# EAGLE design Own_RPi.Streamerboard.pro_v1.3_Final_AR (EAGLE 9.6.2)
COMPANY: ADAFRUIT INDUSTRIES; DRAWN: KTOWN; REV: A; YEAR: 2019
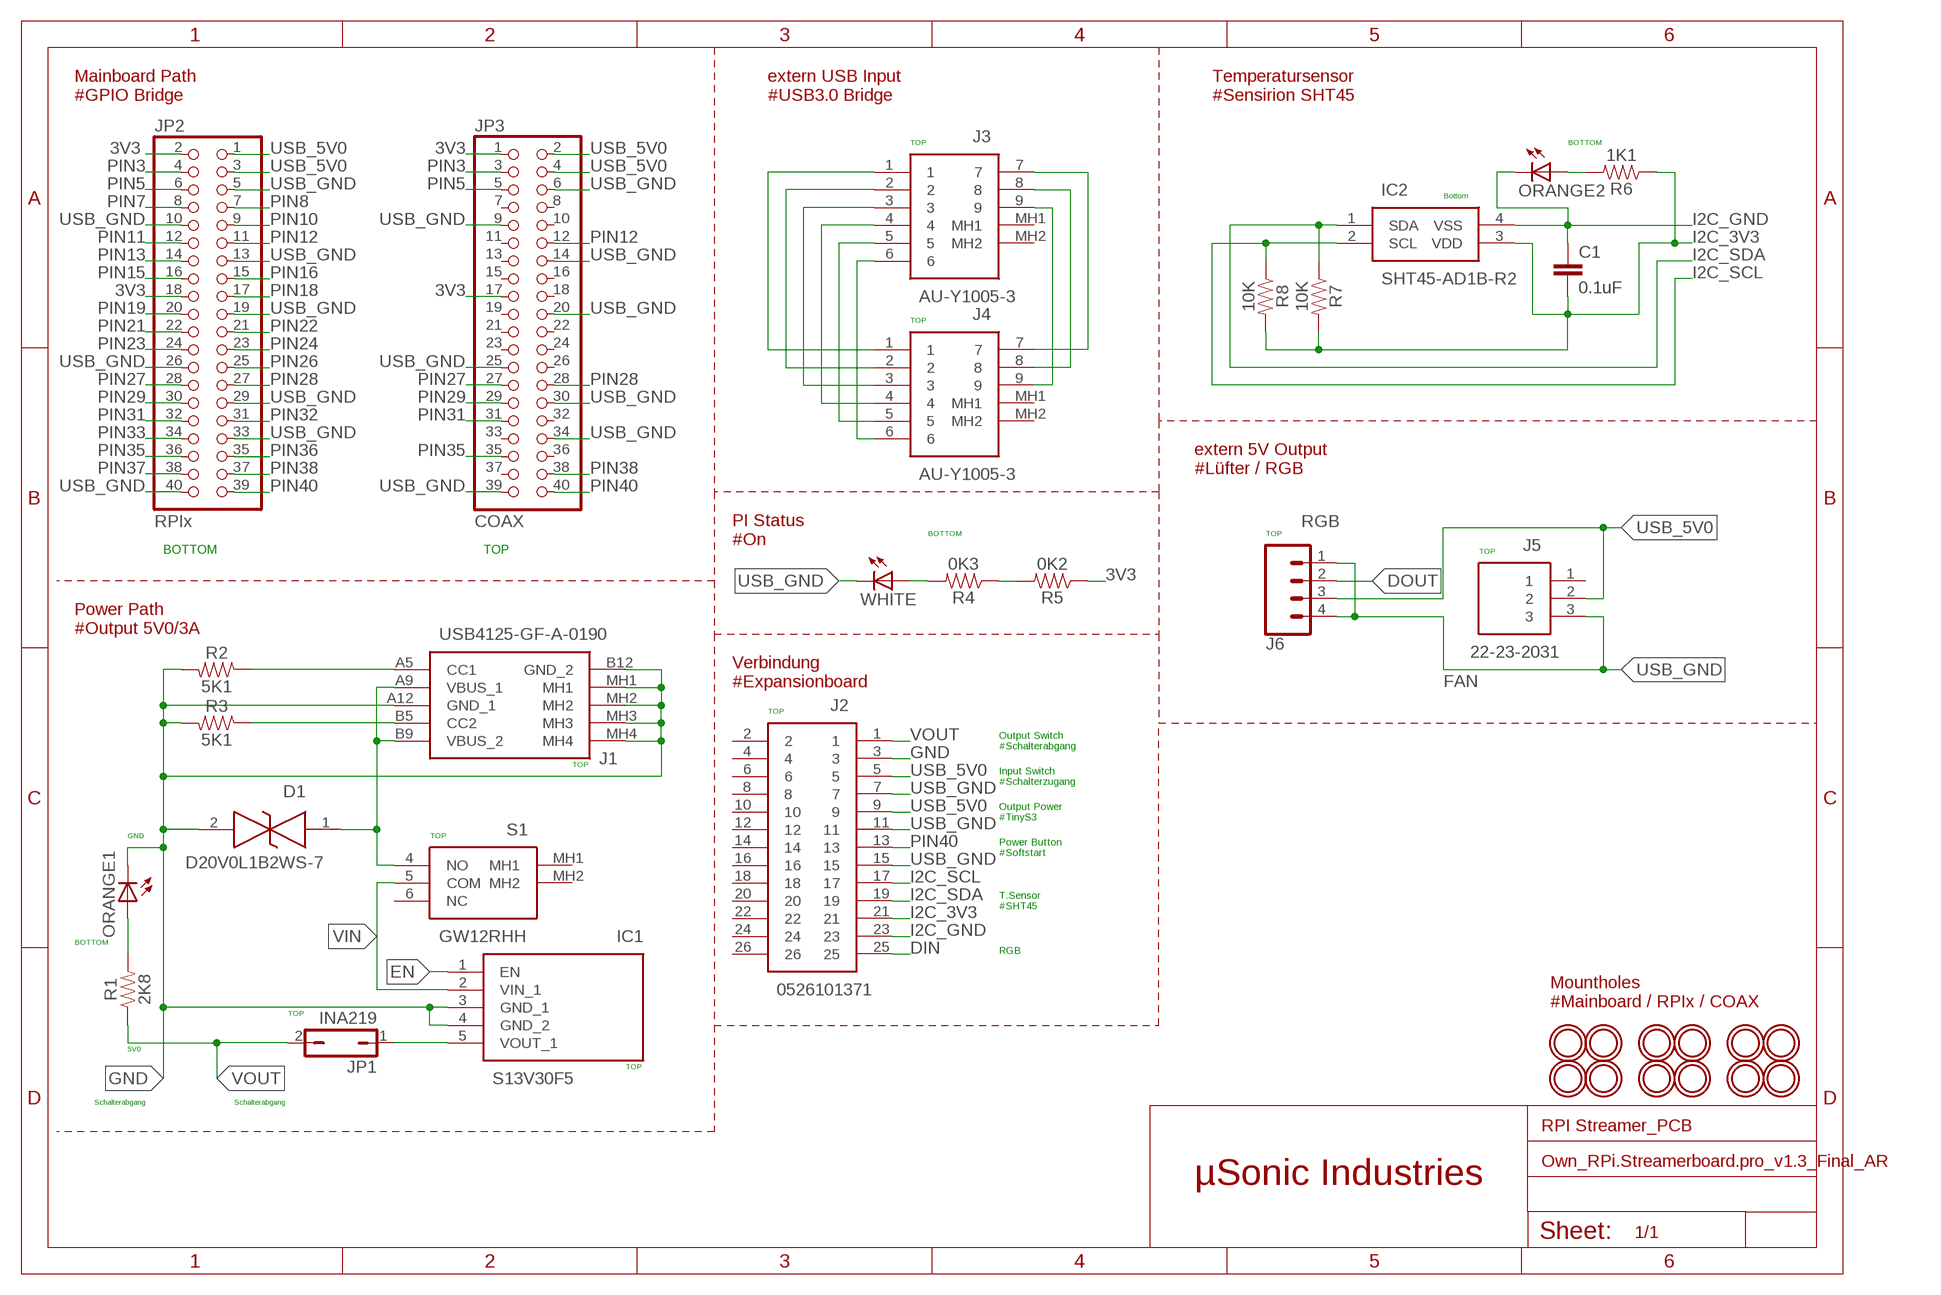
[diagram p0: schematic, sheet 1]

## Parts
C1  0.1uF  1.0UF-0805-25V-10%  [0805]
D1  D20V0L1B2WS-7  [SOD2513X120N]
IC1  S13V30F5  [S13V30F5]
IC2  SHT45-AD1B-R2  [SHT45AD1BR2]
J1  USB4125-GF-A-0190  [USB4125GFA0190]
J2  0526101371  [0526101371]
J3  AU-Y1005-3  [AUY10053]
J4  AU-Y1005-3  [AUY10053]
J5  22-23-2031  [SHDR3W82P0X254_1X3_747X635X818]
J6  CONN_041X04_NO_SILK  [1X04_NO_SILK]
JP1  INA219  JP1Q2JP2  [1X02_NO_SILK]
JP2  RPIx  PINHD-2X20-BIG  [2X20-BIG]
JP3  COAX  PINHD-2X20-BIG  [2X20-BIG]
ORANGE1  LEDCHIPLED_0805  [CHIPLED_0805]
ORANGE2  LEDCHIPLED_0805  [CHIPLED_0805]
R1  2K8  RESISTOR0805  [0805]
R2  5K1  RESISTOR0805  [0805]
R3  5K1  RESISTOR0805  [0805]
R4  0K3  RESISTOR0805  [0805]
R5  0K2  RESISTOR0805  [0805]
R6  1K1  RESISTOR0805  [0805]
R7  10K  RESISTOR0805  [0805]
R8  10K  RESISTOR0805  [0805]
S1  GW12RHH  [GW12RHH]
U$4  MOUNTINGHOLE2.5  [MOUNTINGHOLE_2.5_PLATED]
U$5  MOUNTINGHOLE2.5  [MOUNTINGHOLE_2.5_PLATED]
U$6  MOUNTINGHOLE2.5  [MOUNTINGHOLE_2.5_PLATED]
U$7  MOUNTINGHOLE2.5  [MOUNTINGHOLE_2.5_PLATED]
U$8  MOUNTINGHOLE2.5  [MOUNTINGHOLE_2.5_PLATED]
U$10  MOUNTINGHOLE2.5  [MOUNTINGHOLE_2.5_PLATED]
U$11  MOUNTINGHOLE2.5  [MOUNTINGHOLE_2.5_PLATED]
U$13  MOUNTINGHOLE2.5  [MOUNTINGHOLE_2.5_PLATED]
U$14  MOUNTINGHOLE2.5  [MOUNTINGHOLE_2.5_PLATED]
U$15  MOUNTINGHOLE2.5  [MOUNTINGHOLE_2.5_PLATED]
U$16  MOUNTINGHOLE2.5  [MOUNTINGHOLE_2.5_PLATED]
U$17  MOUNTINGHOLE2.5  [MOUNTINGHOLE_2.5_PLATED]
WHITE  LEDCHIPLED_0805  [CHIPLED_0805]

## Nets
3V3: JP2.2 JP2.18 JP3.1 JP3.17 R5.1
DIN: J2.25
DOUT: J6.2
EN: IC1.1(EN)
GND: D1.2 IC1.3(GND_1) IC1.4(GND_2) J1.A12(GND_1) J1.B12(GND_2) J1.MH1 J1.MH2 J1.MH3 J1.MH4 J2.3 ORANGE1.C R2.2 R3.2
I2C_3V3: C1.2 IC2.3(VDD) J2.21 R6.1 R7.2 R8.2
I2C_GND: C1.1 IC2.4(VSS) J2.23 ORANGE2.C
I2C_SCL: IC2.2(SCL) J2.17 R8.1
I2C_SDA: IC2.1(SDA) J2.19 R7.1
N$1: ORANGE1.A R1.2
N$2: R4.1 R5.2
N$3: J1.B5(CC2) R3.1
N$4: J1.A5(CC1) R2.1
N$5: J3.4 J4.4
N$6: ORANGE2.A R6.2
N$7: R4.2 WHITE.A
N$8: IC1.5(VOUT_1) JP1.1
N$15: J3.6 J4.6
N$17: J3.5 J4.5
N$19: J3.3 J4.3
N$20: J3.2 J4.2
N$21: J3.1 J4.1
N$22: J3.9 J4.9
N$23: J3.8 J4.8
N$24: J3.7 J4.7
PIN3: JP2.4 JP3.3
PIN5: JP2.6 JP3.5
PIN7: JP2.8
PIN8: JP2.7
PIN10: JP2.9
PIN11: JP2.12
PIN12: JP2.11 JP3.12
PIN13: JP2.14
PIN15: JP2.16
PIN16: JP2.15
PIN18: JP2.17
PIN19: JP2.20
PIN21: JP2.22
PIN22: JP2.21
PIN23: JP2.24
PIN24: JP2.23
PIN26: JP2.25
PIN27: JP2.28 JP3.27
PIN28: JP2.27 JP3.28
PIN29: JP2.30 JP3.29
PIN31: JP2.32 JP3.31
PIN32: JP2.31
PIN33: JP2.34
PIN35: JP2.36 JP3.35
PIN36: JP2.35
PIN37: JP2.38
PIN38: JP2.37 JP3.38
PIN40: J2.13 JP2.39 JP3.40
USB_5V0: J2.5 J2.9 J5.2 J6.3 JP2.1 JP2.3 JP3.2 JP3.4
USB_GND: J2.7 J2.11 J2.15 J5.3 J6.1 J6.4 JP2.5 JP2.10 JP2.13 JP2.19 JP2.26 JP2.29 JP2.33 JP2.40 JP3.6 JP3.9 JP3.14 JP3.20 JP3.25 JP3.30 JP3.34 JP3.39 WHITE.C
VBUS_VIN: D1.1 J1.A9(VBUS_1) J1.B9(VBUS_2) S1.4(NO)
VIN: IC1.2(VIN_1) S1.5(COM)
VOUT: J2.1 JP1.2 R1.1
Unconnected: J2.2 J2.4 J2.6 J2.8 J2.10 J2.12 J2.14 J2.16 J2.18 J2.20 J2.22 J2.24 J2.26 J3.MH1 J3.MH2 J4.MH1 J4.MH2 J5.1 JP3.7 JP3.8 JP3.10 JP3.11 JP3.13 JP3.15 JP3.16 JP3.18 JP3.19 JP3.21 JP3.22 JP3.23 JP3.24 JP3.26 JP3.32 JP3.33 JP3.36 JP3.37 S1.6(NC) S1.MH1 S1.MH2

## Notes on the sheet
- Mainboard Path
  #GPIO Bridge
- extern USB Input
  #USB3.0 Bridge
- Temperatursensor
  #Sensirion SHT45
- TOP | BOTTOM
- Bottom
- TOP
- extern 5V Output
  #Lüfter / RGB
- RGB
- BOTTOM | TOP
- PI Status
  #On
- BOTTOM | TOP | TOP
- Power Path
  #Output 5V0/3A
- Verbindung
  #Expansionboard
- FAN
- TOP
- Output Switch
  #Schalterabgang
- TOP
- Input Switch
  #Schalterzugang
- Output Power
  #TinyS3
- GND | TOP
- Power Button
  #Softstart
- T.Sensor
  #SHT45
- BOTTOM
- RGB
- Mountholes
  #Mainboard / RPIx / COAX
- TOP
- 5V0
- TOP
- Schalterabgang | Schalterabgang
- RPI Streamer_PCB
- µSonic Industries

## Library data of the parts
C1 = SparkFun-Capacitors:1.0UF: 1µF ceramic capacitors A capacitor is a passive two-terminal electrical component used to store electrical energy temporarily in an electric field.; PROD_ID: CAP-08064; VALUE: 1.0uF
D1 = D20V0L1B2WS-7:D20V0L1B2WS-7: Diodes Inc D20V0L1B2WS-7 Bi-Directional TVS Diode, 90W peak, 2-Pin SOD-323 Source: Datasheet <https://www.diodes.com/assets/Datasheets/D20V0L1B2WS.pdf>; DESCRIPTION: Diodes Inc D20V0L1B2WS-7 Bi-Directional TVS Diode, 90W peak, 2-Pin SOD-323; HEIGHT: 1.2mm; MANUFACTURER_NAME: Diodes Inc.; MANUFACTURER_PART_NUMBER: D20V0L1B2WS-7
IC1 = S13V30F5mod:S13V30F5: 5V Step-Up/Step-Down Voltage Regulator Source: Datasheet <https://www.pololu.com/file/0J1807/5v-step-up-step-down-voltage-regulator-s13v30f5-dimensions.pdf>; DESCRIPTION: 5V Step-Up/Step-Down Voltage Regulator; HEIGHT: 9.57mm; MANUFACTURER_NAME: Pololu; MANUFACTURER_PART_NUMBER: S13V30F5
IC2 = SHT45-AD1B-R2:SHT45-AD1B-R2: 4 4th Generation, High-Accuracy, Ultra-Low-Power, 16-bit Relative Humidity and Temperature Sensor Source: Datasheet <https://www.mouser.de/datasheet/2/682/Datasheet_SHT4x-2936319.pdf>; ARROW_PART_NUMBER: SHT45-AD1B-R2; ARROW_PRICE-STOCK: https://www.arrow.com/en/products/sht45-ad1b-r2/sensirion-ag?region=nac; DESCRIPTION: 4 4th Generation, High-Accuracy, Ultra-Low-Power, 16-bit Relative Humidity and Temperature Sensor; HEIGHT: 0.59mm; MANUFACTURER_NAME: Sensirion; MANUFACTURER_PART_NUMBER: SHT45-AD1B-R2; MOUSER_PART_NUMBER: 403-SHT45-AD1B-R2; MOUSER_PRICE-STOCK: https://www.mouser.co.uk/ProductDetail/Sensirion/SHT45-AD1B-R2?qs=Znm5pLBrcAImXcmTJwn%2FTg%3D%3D
J1 = USB4125-GF-A-0190mod:USB4125-GF-A-0190: USB Connectors USB C Rec GF RA 6P SMT TH Stakes 1.9mm Source: Datasheet <https://eu.mouser.com/datasheet/2/837/usb4125-2448699.pdf>; DESCRIPTION: USB Connectors USB C Rec GF RA 6P SMT TH Stakes 1.9mm; HEIGHT: 3.41mm; MANUFACTURER_NAME: GCT (GLOBAL CONNECTOR TECHNOLOGY); MANUFACTURER_PART_NUMBER: USB4125-GF-A-0190; MOUSER_PART_NUMBER: 640-USB4125-GF-A-190; MOUSER_PRICE-STOCK: https://www.mouser.co.uk/ProductDetail/GCT/USB4125-GF-A-0190?qs=QNEnbhJQKvbCz4hEJBS24w%3D%3D
J2 = 0526101371mod:0526101371: Conn FFC/FPC Connector SKT 13 POS 1mm Solder ST SMD Easy-On T/R Source: Datasheet <https://www.molex.com/pdm_docs/sd/526101371_sd.pdf>; ARROW_PART_NUMBER: 0526101433; ARROW_PRICE-STOCK: https://www.arrow.com/en/products/0526101433/molex; DESCRIPTION: Conn FFC/FPC Connector SKT 14 POS 1mm Solder ST SMD Easy-On T/R; HEIGHT: 6.05mm; MANUFACTURER_NAME: Molex; MANUFACTURER_PART_NUMBER: 0526101433; MOUSER_PART_NUMBER: N/A; MOUSER_PRICE-STOCK: https://www.mouser.com/Search/Refine.aspx?Keyword=N%2FA
J3 J4 = AU-Y1005-3:AU-Y1005-3: CONN USB 3.0 R/A FMAL TYPE-A PCB Source: Datasheet <https://datasheet.datasheetarchive.com/originals/distributors/DKDS-12/221023.pdf>; ARROW_PART_NUMBER: AU-Y1005-3; ARROW_PRICE-STOCK: https://www.arrow.com/en/products/au-y1005-3/assmann-wsw-components-inc?region=nac; DESCRIPTION: CONN USB 3.0 R/A FMAL TYPE-A PCB; HEIGHT: 7.2mm; MANUFACTURER_NAME: ASSMANN WSW components GmbH; MANUFACTURER_PART_NUMBER: AU-Y1005-3
J5 = 22-23-2031:22-23-2031: 2.54mm,header,KK,vert,Sn,frictn lock,3w Molex KK 254 Series, Series Number 6373, 2.54mm Pitch 3 Way 1 Row Straight PCB Header, Through Hole, Solder Termination Source: Datasheet <http://www.molex.com/webdocs/datasheets/pdf/en-us//0022232031_PCB_HEADERS.pdf>; DESCRIPTION: 2.54mm,header,KK,vert,Sn,frictn lock,3w Molex KK 254 Series, Series Number 6373, 2.54mm Pitch 3 Way 1 Row Straight PCB Header, Through Hole, Solder Termination; HEIGHT: 8.18mm; MANUFACTURER_NAME: Molex; MANUFACTURER_PART_NUMBER: 22-23-2031; MOUSER_PART_NUMBER: 538-22-23-2031; MOUSER_PRICE-STOCK: https://www.mouser.co.uk/ProductDetail/Molex/22-23-2031?qs=ILqg114nvd41XyIAFDpXfw%3D%3D
J6 = SparkFun-Connectors:CONN_04: Multi connection point. Often used as Generic Header-pin footprint for 0.1 inch spaced/style header connections On any of the 0.1 inch spaced packages, you can populate with these: Break Away Headers - Straight <https://www.sparkfun.com/products/116> (PRT-00116) Break Away Male Headers - Right Angle <https://www.sparkfun.com/products/553> (PRT-00553) Female Headers <https://www.sparkfun.com/products/115> (PRT-00115) Break Away Headers - Machine Pin <https://www.sparkfun.com/products/117> (PRT-00117) Break Away Female Headers - Swiss Machine Pin <https://www.sparkfun.com/products/743> (PRT-00743) For SCREWTERMINALS and SPRING TERMINALS visit here: Screw Terimnals on SparkFun.com <https://www.sparkfun.com/search/results?term=Screw+Terminals> (5mm/3.5mm/2.54mm spacing) This device is also useful as a general connection point to wire up your design to another part of your project. Our various solder wires solder well into these plated through hole pads. Hook-Up Wire - Assortment (Stranded, 22 AWG) <https://www.sparkfun.com/products/11375> (PRT-11375) Hook-Up Wire - Assortment (Solid Core, 22 AWG) <https://www.sparkfun.com/products/11367> (PRT-11367) View the entire wire category on our website here <https://www.sparkfun.com/categories/141> Special notes: Molex polarized connector foot print use with SKU : PRT-08231 with associated crimp pins and housings. 1MM SMD Version SKU: PRT-10208; PROD_ID: CONN-09696
JP1 = jumper2:JP1Q2: JUMPER
JP2 JP3 = adafruit:PINHD-2X20: PIN HEADER
ORANGE1 ORANGE2 WHITE = adafruit:LED: LED OSRAM: - CHIPLED LG R971, LG N971, LY N971, LG Q971, LY Q971, LO R971, LY R971 LH N974, LH R974 LS Q976, LO Q976, LY Q976 LO Q996 - Hyper CHIPLED LW Q18S LB Q993, LB Q99A, LB R99A - SideLED LS A670, LO A670, LY A670, LG A670, LP A670 LB A673, LV A673, LT A673, LW A673 LH A674 LY A675 LS A676, LA A676, LO A676, LY A676, LW A676 LS A679, LY A679, LG A679 - Hyper Micro SIDELED® LS Y876, LA Y876, LO Y876, LY Y876 LT Y87S - SmartLED LW L88C, LW L88S LB L89C, LB L89S, LG L890 LS L89K, LO L89K, LY L89K LS L896, LA L896, LO L896, LY L896 - TOPLED LS T670, LO T670, LY T670, LG T670, LP T670 LSG T670, LSP T670, LSY T670, LOP T670, LYG T670 LG T671, LOG T671, LSG T671 LB T673, LV T673, LT T673, LW T673 LH T674 LS T676, LA T676, LO T676, LY T676, LB T676, LH T676, LSB T676, LW T676 LB T67C, LV T67C, LT T67C, LS T67K, LO T67K, LY T67K, LW E67C LS E67B, LA E67B, LO E67B, LY E67B, LB E67C, LV E67C, LT E67C LW T67C LS T679, LY T679, LG T679 LS T770, LO T770, LY T770, LG T770, LP T770 LB T773, LV T773, LT T773, LW T773 LH T774 LS E675, LA E675, LY E675, LS T675 LS T776, LA T776, LO T776, LY T776, LB T776 LHGB T686 LT T68C, LB T68C - Hyper Mini TOPLED® LB M676 - Mini TOPLED Santana® LG M470 LS M47K, LO M47K, LY M47K Source: http://www.osram.convergy.de/
R1-R8 = SparkFun-Resistors:RESISTOR: Generic Resistor Package
S1 = GW12RHH:GW12RHH: NKK SWITCHES - GW12RHH - Rocker Switch, On-None-On, SPDT, Non Illuminated, Through Hole, Grey, GW Series Source: Datasheet <https://www.nkkswitches.com/pdf/GW.pdf>; ARROW_PART_NUMBER: GW12RHH; ARROW_PRICE-STOCK: https://www.arrow.com/en/products/gw12rhh/nkk-switches?region=nac; DESCRIPTION: NKK SWITCHES - GW12RHH - Rocker Switch, On-None-On, SPDT, Non Illuminated, Through Hole, Grey, GW Series; HEIGHT: 5.4mm; MANUFACTURER_NAME: NKK Switches; MANUFACTURER_PART_NUMBER: GW12RHH; MOUSER_PART_NUMBER: 633-GW12RHH; MOUSER_PRICE-STOCK: https://www.mouser.co.uk/ProductDetail/NKK-Switches/GW12RHH?qs=4EnmSMTL3HPCG3meE6aDvQ%3D%3D
U$4-U$8 U$10 U$11 U$13-U$17 = microbuilder:MOUNTINGHOLE: Mounting Hole For #2 screws (0.086"/2.18mm width, 0.094"/2.4mm hole) use 2.5mm; BOM: EXCLUDE

## Net classes
0 default: width 0.25 mm

## Board
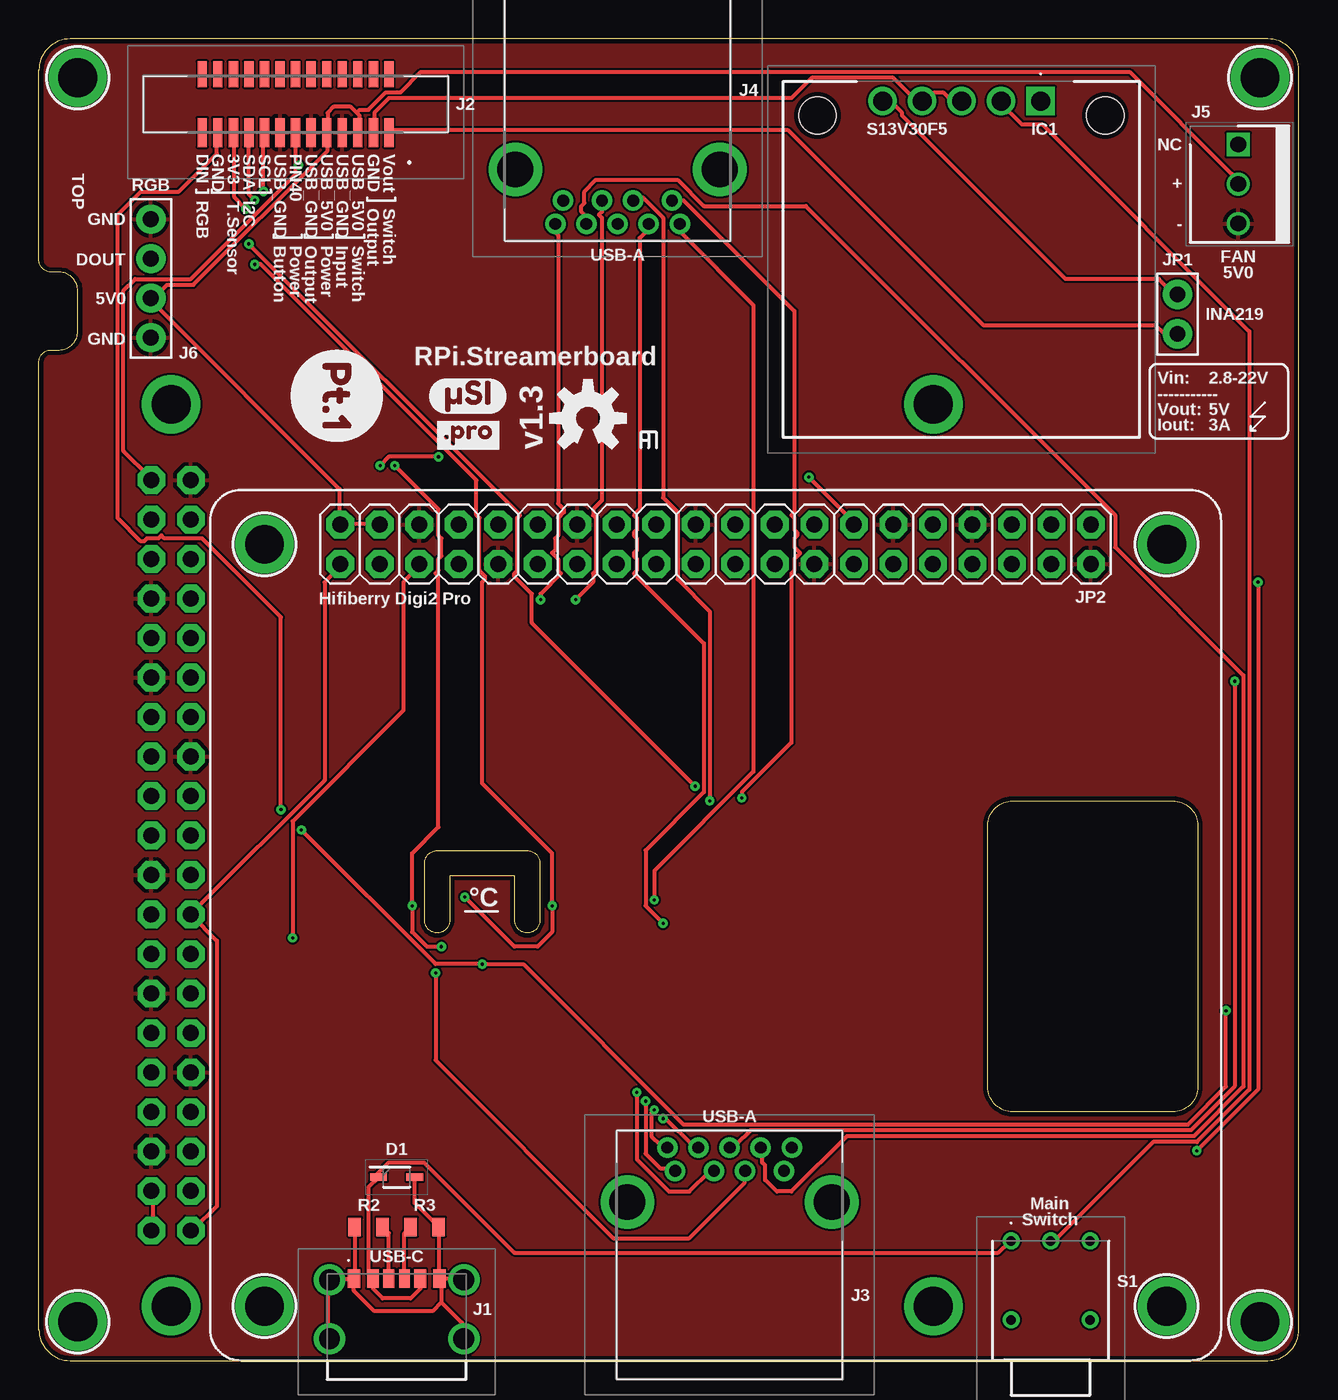
[diagram p1: board, top side]
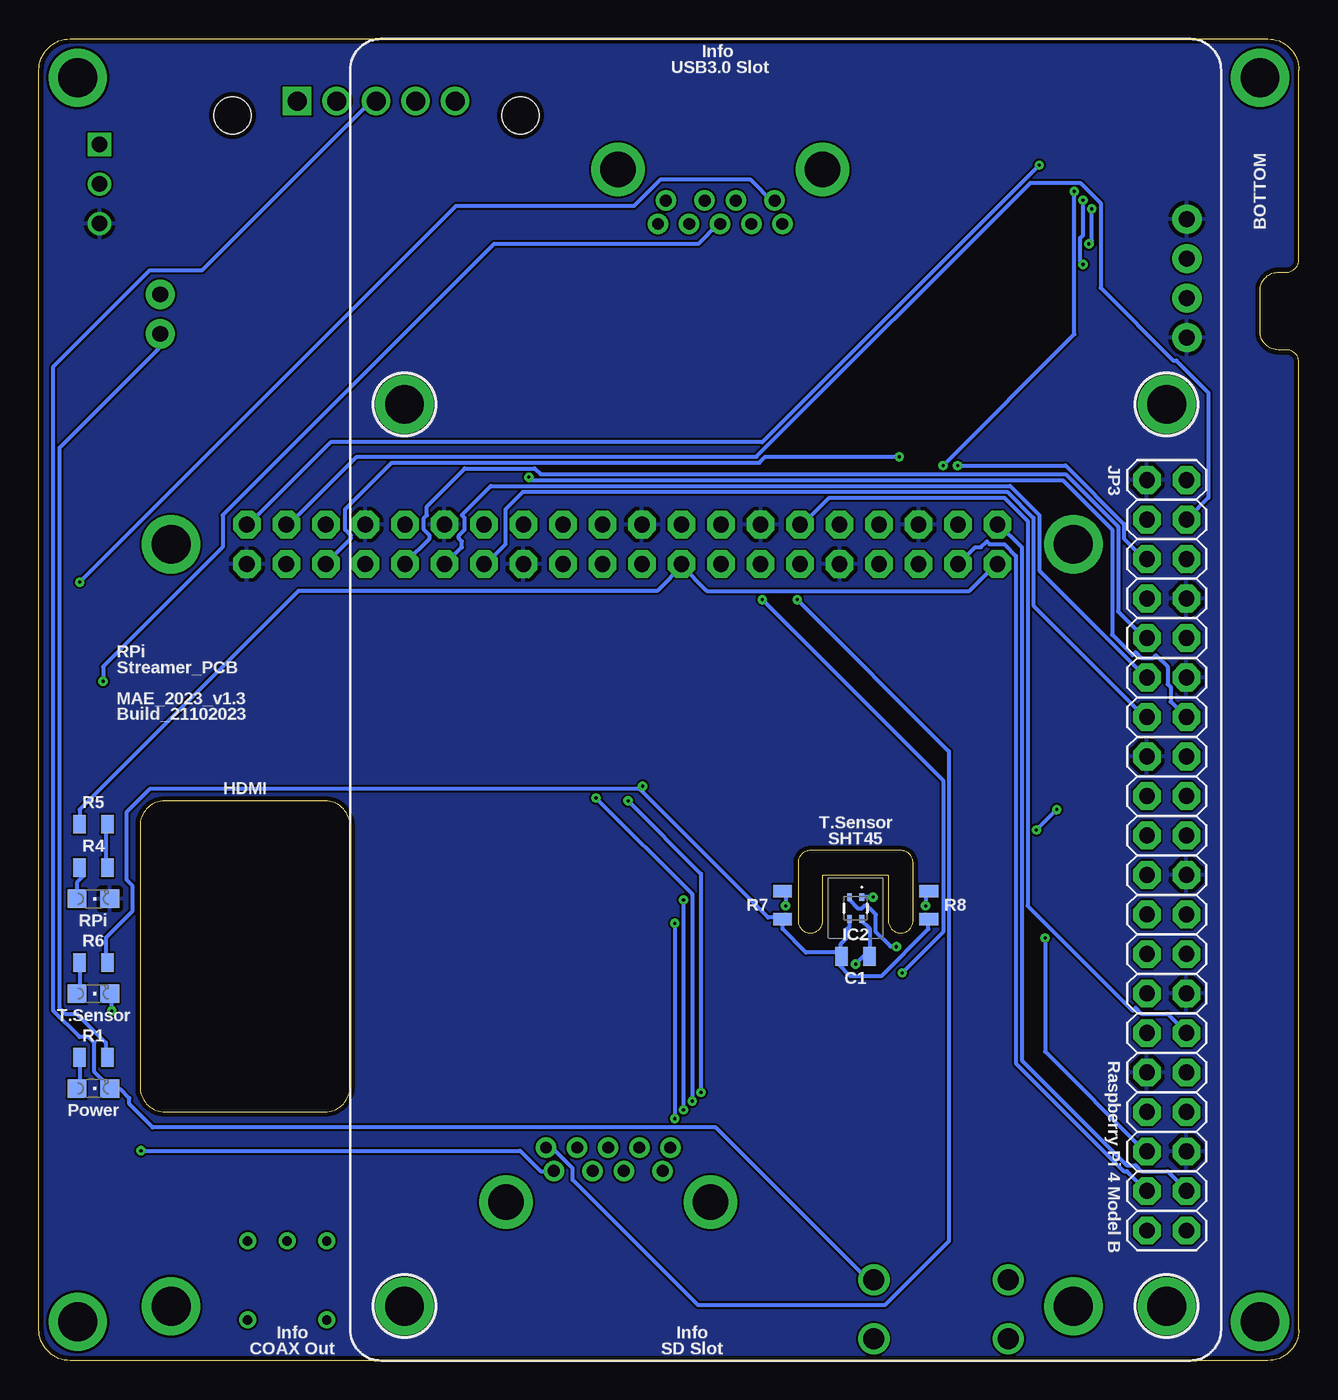
[diagram p2: board, bottom side, seen from below]

Size 81 x 85 mm. Coordinates in mm from the lower left corner, seen from the top.
Outline: 0,70.8 0,83 arc-90 2,85 79,85 arc-90 81,83 81,2 arc-90 79,0 2,0 arc-90 0,2 0,64.2 arc-90 0.8,65 1.3,65 arc90 2.5,66.2 2.5,68.8 arc90 1.3,70 0.8,70 arc-90 0,70.8
Outline: 72.9,16 62.6,16 arc-90 61,17.6 61,34.4 arc-90 62.6,36 72.9,36 arc-90 74.5,34.4 74.5,17.6 arc-90 72.9,16
Outline: 26.4,31.2 26.4,28.3 arc-90 25.6,27.5 arc-90 24.8,28.3 24.8,32 arc-90 25.6,32.8 31.4,32.8 arc-90 32.2,32 32.2,28.3 arc-90 31.4,27.5 arc-90 30.6,28.3 30.6,31.2 26.4,31.2
Copper layers (1*16): Top 0.035mm / dielectric 1.5mm / Bottom 0.035mm
Design rules "aisler_2_layer_complex": minimum track width 0.125mm, minimum drill 0.2mm, track to track 0.125mm, track to pad 0.125mm, pad to pad 0.125mm, via to via 0.125mm, smd to smd 0.125mm, copper to edge 0.3mm, drill to drill 0.25mm, minimum pad ring 0.2mm, minimum via ring 0.2mm, stop-mask expansion 0mil, vias tented up to drill 0mil, thermal gap 10mil

### Footprints (pad centres in the part's own frame; a part is rotated, then mirrored left to right if it is on the bottom)
0805 = smd 0.8 x 1.2: 1 -0.9,0; 2 0.9,0
SOD2513X120N = smd 1.075 x 0.5: 1 -1.162,0; 2 1.162,0
S13V30F5 = drill 1.22 pad 1.83 square: 1 0,0 | drill 1.22 pad 1.83: 2 2.54,0; 3 5.08,0; 4 7.62,0; 5 10.16,0 | hole 2.38: -4.15,0.93; 14.35,0.93
SHT45AD1BR2 = smd 0.5 x 0.3: 1 -0.7,0.4; 2 -0.7,-0.4; 3 0.7,-0.4; 4 0.7,0.4
USB4125GFA0190 = smd 0.7 x 1.2: A5 -0.5,3.08; B5 0.5,3.08 | smd 0.76 x 1.2: A9 1.52,3.08; B9 -1.52,3.08 | smd 0.8 x 1.2: A12 2.75,3.08; B12 -2.75,3.08 | drill 1.34 pad 2.01: MH1 -4.32,3; MH2 -4.32,-0.8; MH3 4.32,-0.8; MH4 4.32,3
0526101371 = smd 0.6 x 1.85: 1 -6,1.825; 3 -5,1.825; 5 -4,1.825; 7 -3,1.825; 9 -2,1.825; 11 -1,1.825; 13 0,1.825; 15 1,1.825; 17 2,1.825; 19 3,1.825; 21 4,1.825; 23 5,1.825; 25 6,1.825 | smd 0.6 x 1.65: 2 -6,-1.925; 4 -5,-1.925; 6 -4,-1.925; 8 -3,-1.925; 10 -2,-1.925; 12 -1,-1.925; 14 0,-1.925; 16 1,-1.925; 18 2,-1.925; 20 3,-1.925; 22 4,-1.925; 24 5,-1.925; 26 6,-1.925
AUY10053 = drill 0.77 pad 1.32: 1 0,0; 2 2,0; 3 4,0; 4 6,0; 5 8,0; 6 0.5,-1.5; 7 3,-1.5; 8 5,-1.5; 9 7.5,-1.5 | drill 2.3 pad 3.45: MH1 -2.57,-3.5; MH2 10.57,-3.5
SHDR3W82P0X254_1X3_747X635X818 = drill 1 pad 1.5 square: 1 0,0 | drill 1 pad 1.5: 2 2.54,0; 3 5.08,0
1X04_NO_SILK = drill 1.016 pad 1.88: 1 0,0; 2 2.54,0; 3 5.08,0; 4 7.62,0
1X02_NO_SILK = drill 1.016 pad 1.88: 1 -1.27,0; 2 1.27,0
2X20-BIG = drill 1.016 pad 1.778 octagon: 1 -24.13,-1.27; 2 -24.13,1.27; 3 -21.59,-1.27; 4 -21.59,1.27; 5 -19.05,-1.27; 6 -19.05,1.27; 7 -16.51,-1.27; 8 -16.51,1.27; 9 -13.97,-1.27; 10 -13.97,1.27; 11 -11.43,-1.27; 12 -11.43,1.27; 13 -8.89,-1.27; 14 -8.89,1.27; 15 -6.35,-1.27; 16 -6.35,1.27; 17 -3.81,-1.27; 18 -3.81,1.27; 19 -1.27,-1.27; 20 -1.27,1.27; 21 1.27,-1.27; 22 1.27,1.27; 23 3.81,-1.27; 24 3.81,1.27; 25 6.35,-1.27; 26 6.35,1.27; 27 8.89,-1.27; 28 8.89,1.27; 29 11.43,-1.27; 30 11.43,1.27; 31 13.97,-1.27; 32 13.97,1.27; 33 16.51,-1.27; 34 16.51,1.27; 35 19.05,-1.27; 36 19.05,1.27; 37 21.59,-1.27; 38 21.59,1.27; 39 24.13,-1.27; 40 24.13,1.27
CHIPLED_0805 = smd 1.2 x 1.2: A 0,-1.05; C 0,1.05
GW12RHH = drill 0.6 pad 1.1: 4 0,0; 5 2.54,0; 6 5.08,0; MH1 0,-5.08; MH2 5.08,-5.08
MOUNTINGHOLE_2.5_PLATED = drill 2.5 pad 3.2: P$1 0,0

### Placement (x,y rotation side)
C1  28.5,26 180 bottom
D1  23,11.8 0 top
IC1  64.4,81 180 top
IC2  28.5,29.1 270 bottom
J1  23,2.2 0 top
J2  16.5,80.8 180 top
J3  40.4,13.7 0 top
J4  41.2,73.1 180 top
J5  77.1,78.2 270 top
J6  7.2,73.4 270 top
JP1  73.2,67.3 270 top
JP2  8.5,32.5 90 bottom
JP3  43.5,52.5 0 top
ORANGE1  77.5,17.5 270 bottom
ORANGE2  77.5,23.6 270 bottom
R1  77.5,19.5 180 bottom
R2  21.2,8.6 180 top
R3  24.8,8.6 0 top
R4  77.5,31.7 180 bottom
R5  77.5,34.5 0 bottom
R6  77.5,25.6 180 bottom
R7  33.2,29.3 270 bottom
R8  23.8,29.3 270 bottom
S1  62.5,7.7 0 top
U$1  [.PRO_LARGE]  25.6,58.6 0 top
U$2  [OSHW-LOGO-M]  35.3,60.6 0 top
U$3  [PT.1]  16.2,65 270 top
U$4  8.5,3.5 0 bottom
U$5  72.5,3.5 0 top
U$6  8.5,61.5 0 bottom
U$7  72.5,52.5 0 top
U$8  14.5,52.5 0 top
U$10  14.5,3.5 0 top
U$11  57.5,3.5 0 bottom
U$13  78.5,2.5 0 top
U$14  2.5,82.5 0 top
U$15  78.5,82.5 0 top
U$16  2.5,2.5 0 top
U$17  57.5,61.5 0 bottom
U$18  [µSI_LARGE]  25.1,60.9 0 top
WHITE  77.5,29.7 270 bottom

### Tracks (layer width: path | path; a pad name or v marks a point on that pad's centre or on a via)
3V3
  Top 0.25: JP2.2 9.94,8.44 11.44,9.94 11.44,27 9.75,28.69 JP2.18 9.94,28.88 18.38,37.31 18.38,50.06 19.5,51.19 JP3.1
  Bottom 0.25: R5.1 78.38,34.5 78.38,35.44 64.31,49.5 41.25,49.5 39.56,51.19 JP3.17 39.75,51.19 38.06,49.5 21.19,49.5 19.5,51.19 JP3.1
GND
  Top 0.25: D1.2 24.16,10.14 R3.2 25.7,5.33 J1.A12 25.88,5.25 | R2.2 20.3,5.33 J1.B12 20.25,5.25 | J2.3 21.56,79.12 21.56,80.25 22.5,81.19 48.38,81.19 49.69,82.5 54.94,82.5 56.44,81 IC1.4 57,81 57.56,81.56 58.12,81.56 58.69,81 IC1.3 | 20.25,5.25 18.75,5.25 J1.MH1 18.56,5.06 18.56,1.5 J1.MH2 | 25.88,5.25 27.19,5.25 J1.MH4 | 25.88,3.75 27.19,2.44 27.19,1.5 J1.MH3 | 25.88,5.25 25.88,3.75 | 20.25,5.25 20.25,4.5 21.56,3.19 25.31,3.19 25.88,3.75
  Bottom 0.25: J1.MH4 27.38,5.25 27.75,5.25 37.5,15 73.69,15 75.19,16.5 75.19,16.88 75.75,17.44 76.31,17.44 ORANGE1.C 76.5,17.62 77.44,18.56 77.44,20.44 77.81,20.81 78.38,20.81 80.06,22.5 80.06,63.94 73.88,70.12 70.5,70.12 60,80.62 59.81,80.62 59.44,81 IC1.3
I2C_3V3  (via drill 0.2)
  Top 0.25: v13.31,74.06 12.56,74.81 12.56,78.94 J2.21 | v13.5,71.81 30.94,54.38 30.75,54.19 30.75,50.81 30.56,50.62 30.56,50.44 31.69,49.31 31.69,47.44 v42.19,36.94
  Bottom 0.25: 29.44,26.25 29.44,26.06 C1.2 | 29.44,26.25 29.44,26.81 29.06,27.19 29.06,27.75 28.88,27.94 28.88,28.31 IC2.3 | R8.2 23.81,28.31 23.81,27.75 26.81,24.75 28.88,24.75 29.62,25.5 29.62,25.69 29.44,25.88 C1.2 | 29.44,26.25 31.69,26.25 33.19,27.75 33.19,28.31 R7.2 33.38,28.5 34.12,28.5 42.38,36.75 | 29.44,26.25 C1.2 | 42.38,36.75 73.88,36.75 75.38,35.25 75.38,30.94 75,30.56 75,28.88 76.69,27.19 76.69,25.69 R6.1 | v13.31,74.06 13.31,72 v13.5,71.81 | 42.38,36.75 v42.19,36.94
I2C_GND  (via drill 0.2)
  Top 0.25: v76.31,22.5 76.31,17.62 73.88,15.19 41.44,15.19 31.12,25.5 v28.5,25.5 25.5,25.5 v16.88,34.12 | v15.56,35.44 15.56,47.81 10.5,52.88 8.06,52.88 7.88,53.06 7.69,52.88 6.94,52.88 6.75,52.69 6.56,52.69 5.06,54.19 5.06,73.69 6.56,75.19 9,75.19 11.44,77.62 11.44,78.94 J2.23
  Bottom 0.25: 27.56,26.44 27.56,26.06 C1.1 27.56,26.44 | 27.56,26.44 27.56,27.75 28.12,28.31 IC2.4 | v76.31,22.5 76.31,23.44 ORANGE2.C | 27.56,26.44 v28.5,25.5 | v16.88,34.12 v15.56,35.44
I2C_SCL  (via drill 0.2)
  Top 0.25: v25.88,26.62 24.94,26.62 24,27.56 v24,29.25 24,32.62 25.69,34.31 25.69,50.44 25.5,50.62 25.69,50.81 25.69,51.56 25.88,51.75 25.88,52.88 25.69,53.06 25.69,54.75 v22.88,57.56 | v14.44,75.19 14.44,78.94 J2.17
  Bottom 0.25: v25.88,26.62 26.25,26.62 27.19,27.56 27.19,28.69 27.75,29.25 27.94,29.25 28.12,29.06 28.31,29.06 28.88,29.62 IC2.2 | v24,29.25 24,30 R8.1 | v14.44,75.19 14.44,66 v22.88,57.56
I2C_SDA  (via drill 0.2)
  Top 0.25: v27.38,29.81 30.56,26.62 32.06,26.62 33,27.56 v33,29.25 33,32.62 28.5,37.12 28.5,50.06 28.69,50.25 28.69,50.44 28.31,50.81 28.31,54.19 28.12,54.38 28.12,56.62 14.25,70.5 v13.88,70.5 | J2.19 13.5,75 v13.88,74.62
  Bottom 0.25: v27.38,29.81 28.12,29.81 IC2.1 | v33,29.25 33,30 R7.1 | v13.88,74.62 13.88,72.38 14.06,72.19 14.06,70.69 v13.88,70.5
N$1
  Bottom 0.25: ORANGE1.A 78.38,17.62 78.38,19.5 R1.2
N$2
  Bottom 0.25: R4.1 76.69,31.88 76.69,34.5 R5.2
N$3
  Top 0.25: J1.B5 23.5,8.2 R3.1
N$4
  Top 0.25: J1.A5 22.5,8.2 R2.1
N$5
  Top 0.25: J3.4 46.5,13.69 46.5,12.75 46.69,12.56 46.69,11.62 47.44,10.88 48.38,10.88 51.94,14.44 74.25,14.44 77.44,17.62 77.44,44.06 69.19,52.31 69.19,54.38 49.31,74.25 42.75,74.25 41.06,75.94 35.81,75.94 35.06,75.19 35.06,74.44 34.88,74.25 34.88,73.88 35.06,73.69 35.06,73.12 J4.4
N$6
  Bottom 0.25: ORANGE2.A 78.38,23.62 78.38,25.5 R6.2
N$7
  Bottom 0.25: WHITE.A 78.56,29.81 78.56,30.75 78.19,31.12 78.19,31.5 78.38,31.69 R4.2
N$8
  Top 0.25: IC1.5 54.75,81 55.5,80.25 55.5,80.06 66,69.56 72,69.56 73.12,68.44 JP1.1
N$15  (via drill 0.2)
  Top 0.25: v39,16.69 39,13.31 39.94,12.38 40.88,12.38 J3.6 | v45.19,36.19 45.19,36.56 48.38,39.75 48.38,50.62 48.56,50.81 48.56,51.56 48.94,51.94 48.56,52.31 48.56,52.88 48.75,53.06 48.75,53.25 48.56,53.44 48.56,54.19 48.38,54.38 48.56,54.56 48.56,67.5 41.44,74.62 40.88,74.62 J4.6
  Bottom 0.25: v39,16.69 39,30 v45.19,36.19
N$17  (via drill 0.2)
  Top 0.25: v32.25,48.94 32.25,49.31 33.56,50.62 33.38,50.81 33.38,51.56 33,51.94 33.19,52.12 33.19,52.88 33.38,53.06 33.38,54.19 33.75,54.56 33.75,54.75 33.38,55.12 33.38,72.38 33.19,72.56 33.19,72.94 J4.5
  Bottom 0.25: v32.25,48.94 22.5,39.19 22.5,7.69 26.62,3.56 38.62,3.56 46.69,11.62 46.69,12.38 48,13.69 48.38,13.69 J3.5
N$19  (via drill 0.2)
  Top 0.25: v76.88,43.69 76.88,17.62 74.06,14.81 45.75,14.81 44.81,13.88 44.44,13.88 J3.3
  Bottom 0.25: v76.88,43.69 76.88,44.62 69.19,52.31 69.19,54.38 51.75,71.81 38.62,71.81 37.31,73.12 J4.3
N$20  (via drill 0.2)
  Top 0.25: v40.12,15.56 40.31,15.56 42,13.88 42.38,13.88 J3.2 | v40.12,28.12 39,29.25 39,32.81 42.75,36.56 42.75,46.12 38.25,50.62 38.44,50.81 38.44,51.56 38.25,51.75 38.25,51.94 38.44,52.12 38.44,52.88 38.25,53.06 38.25,53.25 38.44,53.44 38.44,54.19 38.25,54.38 38.62,54.75 38.62,72.19 39.38,72.94 J4.2
  Bottom 0.25: v40.12,28.12 v40.12,15.56
N$21  (via drill 0.2)
  Top 0.25: v39.56,16.12 39.38,15.94 39.38,14.44 39.94,13.88 40.31,13.88 J3.1 | v39.56,29.62 39.56,31.5 45.94,37.88 45.94,67.88 41.25,72.56 41.25,72.94 J4.1
  Bottom 0.25: v39.56,29.62 v39.56,16.12
N$22  (via drill 0.2)
  Top 0.25: v74.44,13.5 78.38,17.44 v78.38,50.06
  Bottom 0.25: v74.44,13.5 50.06,13.5 48.75,12.19 48,12.19 J3.9 | v78.38,50.06 54.19,74.25 42.75,74.25 41.06,75.94 35.25,75.94 33.75,74.44 J4.9
N$23  (via drill 0.2)
  Top 0.25: v25.5,24.94 25.5,19.31 36.94,7.88 41.81,7.88 45.38,11.44 45.38,12.19 J3.8 | v34.5,48.94 35.62,50.06 35.62,50.62 35.81,50.81 35.81,54.19 35.62,54.38 35.62,54.75 36.19,55.31 36.19,73.5 36,73.69 36.19,73.88 36.19,74.44 J4.8
  Bottom 0.25: v25.5,24.94 22.88,27.56 22.88,37.31 v34.5,48.94
N$24  (via drill 0.2)
  Top 0.25: v38.44,17.25 38.44,12.94 40.5,10.88 41.81,10.88 43.12,12.19 43.31,12.19 J3.7 | v43.12,36 43.12,48.19 41.06,50.25 41.06,54.56 40.12,55.5 40.12,73.5 38.81,74.81 38.44,74.81 38.25,74.62 J4.7
  Bottom 0.25: v38.44,17.25 38.44,31.31 v43.12,36
PIN3
  Bottom 0.25: JP2.4 9.94,11.06 11.06,12.19 11.25,12.19 18.19,19.12 18.19,51.75 18.94,52.5 19.88,52.5 20.06,52.69 20.44,52.31 20.81,52.31 21.75,51.38 JP3.3
PIN5  (via drill 0.2)
  Top 0.25: v16.31,27.19 16.31,34.69 23.44,41.81 23.44,50.06 24.56,51.19 JP3.5
  Bottom 0.25: v16.31,27.19 16.31,19.88 9.94,13.5 JP2.6
PIN12
  Bottom 0.25: JP2.11 7.31,21.19 8.44,22.31 10.12,22.31 10.5,22.69 10.69,22.5 17.44,29.25 17.44,54 18.94,55.5 30.19,55.5 32.06,53.62 JP3.12
PIN27
  Bottom 0.25: JP2.28 9.94,41.44 17.06,48.56 17.06,54.19 18.75,55.88 49.88,55.88 51,54.75 51,52.5 52.31,51.19 JP3.27
PIN28  (via drill 0.2)
  Top 0.25: v49.5,56.81 52.5,53.81 JP3.28
  Bottom 0.25: v49.5,56.81 49.31,56.62 15.19,56.62 12,53.44 12,46.69 10.69,45.38 10.5,45.56 10.12,45.19 9.38,45.19 9.19,45.38 8.44,44.62 8.44,43.5 8.25,43.31 8.25,42.38 7.31,41.44 JP2.27
PIN29
  Bottom 0.25: JP2.30 9.94,44.06 16.69,50.81 16.69,54.38 18.56,56.25 51.94,56.25 53.81,54.38 53.62,54.19 53.62,53.44 54,53.06 54,52.88 53.81,52.69 53.81,52.31 54.75,51.38 JP3.29
PIN31
  Bottom 0.25: JP2.32 9.94,46.5 11.62,48.19 11.62,53.62 15,57 48.75,57 49.12,57.38 53.62,57.38 56.06,54.94 56.06,54.38 56.25,54.19 56.25,53.44 55.88,53.06 55.88,52.88 57.38,51.38 JP3.31
PIN35  (via drill 0.2)
  Top 0.25: v21.94,57.56 22.5,58.12 v25.69,58.12
  Bottom 0.25: v21.94,57.56 15,57.56 11.25,53.81 11.25,52.88 9.94,51.56 JP2.36 | v25.69,58.12 34.31,58.12 34.69,57.75 58.31,57.75 61.31,54.75 61.31,53.44 60.94,53.06 60.94,52.88 62.44,51.38 JP3.35
PIN38
  Bottom 0.25: JP2.37 7.12,54.19 5.81,55.5 5.81,62.25 7.88,64.31 8.06,64.31 12.75,69 12.75,74.44 14.06,75.75 17.25,75.75 34.88,58.12 60.56,58.12 65.06,53.62 JP3.38
PIN40  (via drill 0.2)
  Top 0.25: 16.5,76.88 16.5,76.31 9.75,69.56 6.19,69.56 5.44,68.81 5.44,58.5 7.12,56.81 JP2.39 | 16.5,76.88 J2.13 | 16.5,76.88 v16.69,76.88
  Bottom 0.25: v16.69,76.88 34.5,59.06 62.25,59.06 67.5,53.81 JP3.40
USB_5V0
  Top 0.25: JP2.1 7.31,8.44 7.31,10.88 JP2.3 | JP3.4 21.75,53.81 19.5,53.81 JP3.2 19.31,53.81 19.31,56.06 7.12,68.25 J6.3 7.31,68.25 8.25,69.19 9.94,69.19 18.56,77.81 18.56,78.94 J2.9 18.56,79.12 18.56,80.25 18.94,80.62 20.06,80.62 20.44,80.25 | 20.44,80.25 20.62,80.06 20.62,79.12 J2.5 | 20.44,80.25 20.62,80.44 21.19,80.44 22.31,81.56 23.25,81.56 24.56,82.88 70.12,82.88 76.69,76.31 76.69,76.12 77.06,75.75 J5.2
  Bottom 0.25: JP2.3 7.31,11.06 8.44,12.19 10.12,12.19 10.5,12.56 11.06,12.56 17.81,19.31 17.81,52.31 19.31,53.81 JP3.2
USB_GND
  pour Top: 0,85 0,0 81,0 81,85
  pour Bottom: 0,85 0,0 81,0 81,85
VBUS_VIN
  Top 0.25: J1.A9 24.52,4.62 23.9,4 22.1,4 21.48,4.62 J1.B9 21.2,5.56 21.2,11.16 D1.1 21.56,11.62 21.56,11.81 22.5,12.75 24.75,12.75 30.56,6.94 61.69,6.94 62.44,7.69 S1.4
VIN
  Top 0.25: S1.5 65.06,7.88 65.44,7.88 71.62,14.06 74.44,14.06 77.81,17.44 77.81,66.19 64.5,79.5 63.19,79.5 61.69,81 IC1.2
VOUT
  Top 0.25: J2.1 22.5,79.12 48.19,79.12 60.75,66.56 71.81,66.56 72.38,66 73.12,66 JP1.2
  Bottom 0.25: R1.1 76.69,19.5 76.69,20.44 78.56,22.31 79.31,22.31 79.69,22.69 79.69,58.69 73.31,65.06 73.31,66 JP1.2

### Text on the board
tPlace: J4 | J2 | J5 | S13V30F5 | IC1 | DIN | GND | 3V3 | SDA | SCL | USB_GND | PIN40 | USB_GND | USB_5V0 | USB_GND | USB_5V0 | GND | Vout | NC | + | TOP | RGB | RGB | I2C / T.Sensor | Switch / Output | GND | - | Power / Button | Power / Output | Switch / Input | USB-A | DOUT | FAN / 5V0 | JP1 | 5V0 | INA219 | GND | J6 | RPi.Streamerboard | Vin: / ----------- / Vout: / Iout: | 2.8-22V / / 5V / 3A | v1.3 | JP2 | Hifiberry Digi2 Pro | °C | USB-A | D1 | R2 | R3 | Main / Switch | USB-C | S1 | J3 | J1
bPlace: Info / USB3.0 Slot | BOTTOM | JP3 | RPi / Streamer_PCB / / MAE_2023_v1.3 / Build_21102023 | HDMI | R5 | T.Sensor / SHT45 | R4 | R8 | R7 | RPi | IC2 | R6 | C1 | T.Sensor | R1 | Power | Raspberry Pi 4 Model B | Info / SD Slot | Info / COAX Out